# EAGLE design CAB_decoder_SMD (EAGLE 9.6.1)
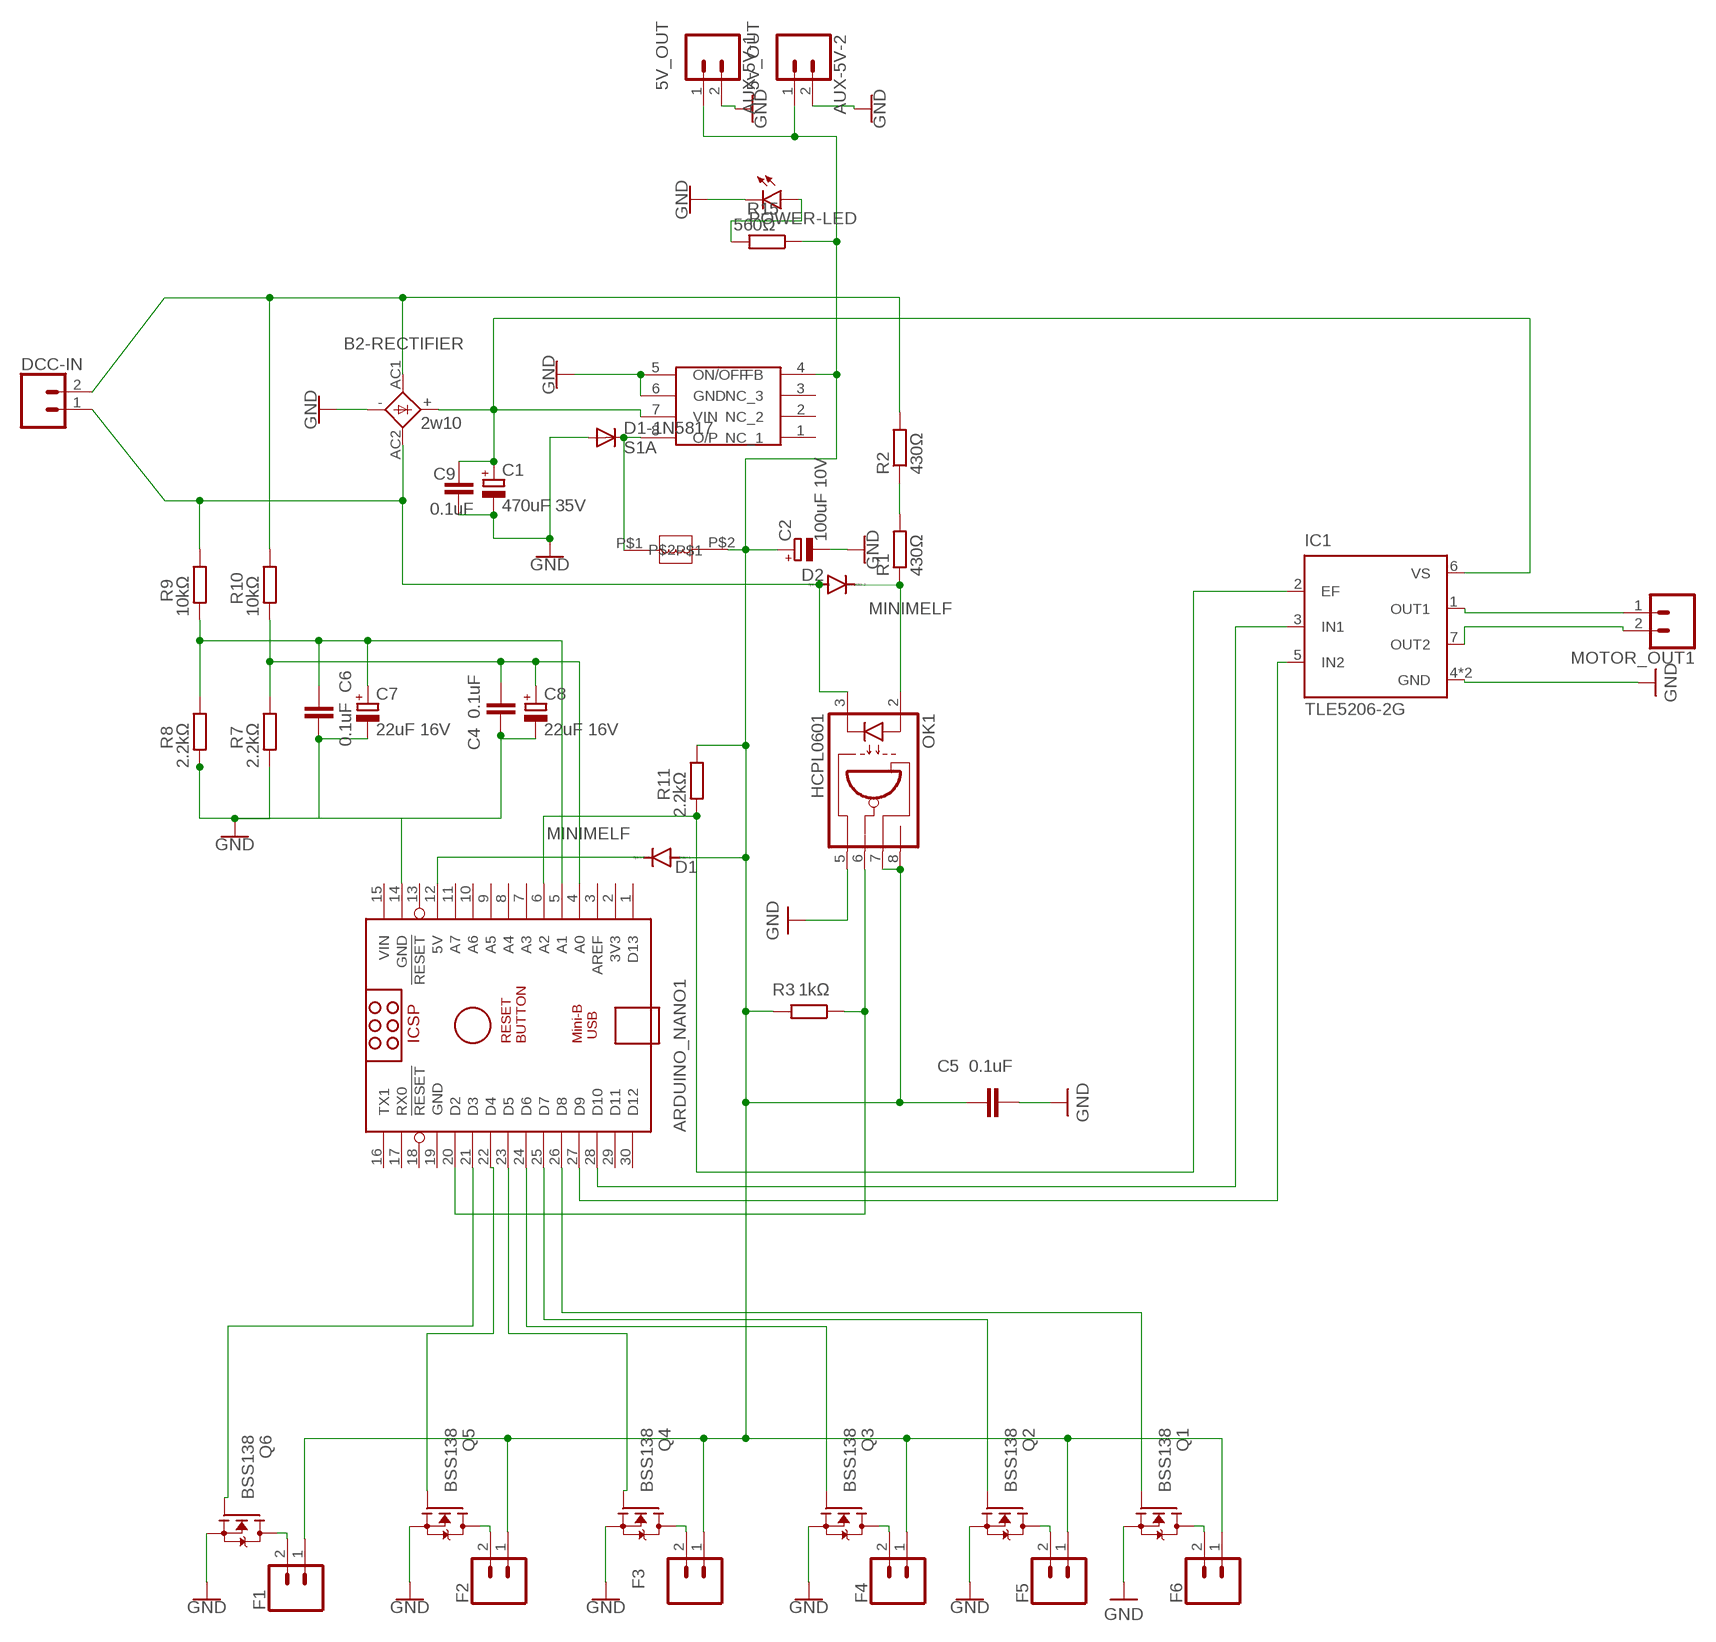
[diagram p0: schematic, sheet 1]

## Parts
ARDUINO_NANO1  ARDUINO_NANO  [ARDUINO_NANO]
AUX-5V-1  5V_OUT  CONN_02POLAR_LOCK  [MOLEX-1X2_LOCK]
AUX-5V-2  5V_OUT  CONN_02POLAR_LOCK  [MOLEX-1X2_LOCK]
B2-RECTIFIER  2w10  1KAB  [1KAB]
C1  470uF 35V  CPOL-EU153CLV-1014  [153CLV-1014]
C2  100uF 10V  CPOL-EU153CLV-0605  [153CLV-0605]
C4  0.1uF  C-EUC1206  [C1206]
C5  0.1uF  C-EUC1206  [C1206]
C6  0.1uF  C-EUC1206  [C1206]
C7  22uF 16V  CPOL-EU153CLV-0405  [153CLV-0405]
C8  22uF 16V  CPOL-EU153CLV-0405  [153CLV-0405]
C9  0.1uF  C-EUC1206  [C1206]
D1  MINIMELF  DIODE-MINIMELF  [MINIMELF]
D1-1N5817  S1A  [DO214AC]
D2  MINIMELF  DIODE-MINIMELF  [MINIMELF]
DCC-IN  CONN_02POLAR_LOCK  [MOLEX-1X2_LOCK]
F1  CONN_02POLAR_LOCK  [MOLEX-1X2_LOCK]
F2  CONN_02POLAR_LOCK  [MOLEX-1X2_LOCK]
F3  CONN_02POLAR_LOCK  [MOLEX-1X2_LOCK]
F4  CONN_02POLAR_LOCK  [MOLEX-1X2_LOCK]
F5  CONN_02POLAR_LOCK  [MOLEX-1X2_LOCK]
F6  CONN_02POLAR_LOCK  [MOLEX-1X2_LOCK]
IC1  TLE5206-2G  [P-TO263-7-1]
MOTOR_OUT1  CONN_02POLAR_LOCK  [MOLEX-1X2_LOCK]
OK1  HCPL0601  [SOIC08]
POWER-LED  LEDCHIPLED_1206  [CHIPLED_1206]
Q1  BSS138  [SOT23]
Q2  BSS138  [SOT23]
Q3  BSS138  [SOT23]
Q4  BSS138  [SOT23]
Q5  BSS138  [SOT23]
Q6  BSS138  [SOT23]
R1  430Ω  R-EU_R2512  [R2512]
R2  430Ω  R-EU_R2512  [R2512]
R3  1kΩ  R-EU_R1206  [R1206]
R7  2.2kΩ  R-EU_R1206  [R1206]
R8  2.2kΩ  R-EU_R1206  [R1206]
R9  10kΩ  R-EU_R1206  [R1206]
R10  10kΩ  R-EU_R1206  [R1206]
R11  2.2kΩ  R-EU_R1206  [R1206]
R15  560Ω  R-EU_R1206  [R1206]
U$1  LM2594  [SOIC8]
U$2  L-CD54  [L_CD54]

## Nets
5V: AUX-5V-1.1 AUX-5V-2.1 C2.+ C5.1 D1.A F1.1 F2.1 F3.1 F4.1 F5.1 F6.1 OK1.7(VE) OK1.8(VCC) R3.2 R11.1 R15.1 U$1.4(FB) U$2.P$2
20V: B2-RECTIFIER.+ C1.+ C9.1 IC1.6(VS) U$1.7(VIN)
GND: ARDUINO_NANO1.14(GND) AUX-5V-1.2 AUX-5V-2.2 B2-RECTIFIER.- C1.- C2.- C4.1 C5.2 C6.2 C7.- C8.- C9.2 D1-1N5817.A IC1.4(GND) IC1.8(GND) OK1.5(GND) POWER-LED.C Q1.2(S) Q2.2(S) Q3.2(S) Q4.2(S) Q5.2(S) Q6.2(S) R7.2 R8.2 U$1.5(ON/OFF) U$1.6(GND)
HV-DCC-SIG-ONE: B2-RECTIFIER.AC2 D2.A DCC-IN.1 OK1.3(C) R9.1
HV-DCC-SIG-TWO: B2-RECTIFIER.AC1 DCC-IN.2 R2.2 R10.1
N$1: D1-1N5817.C U$1.8(O/P) U$2.P$1
N$2: ARDUINO_NANO1.22(D4) Q5.1(G)
N$3: D2.C OK1.2(A) R1.1
N$4: ARDUINO_NANO1.6(A2) IC1.2(EF) R11.2
N$5: R1.2 R2.1
N$6: IC1.7(OUT2) MOTOR_OUT1.2
N$7: ARDUINO_NANO1.5(A1) C6.1 C7.+ R8.1 R9.2
N$8: ARDUINO_NANO1.28(D10) IC1.3(IN1)
N$9: ARDUINO_NANO1.27(D9) IC1.5(IN2)
N$10: ARDUINO_NANO1.21(D3) Q6.1(G)
N$11: ARDUINO_NANO1.4(A0) C4.2 C8.+ R7.1 R10.2
N$12: ARDUINO_NANO1.23(D5) Q4.1(G)
N$13: ARDUINO_NANO1.24(D6) Q3.1(G)
N$14: ARDUINO_NANO1.25(D7) Q2.1(G)
N$15: ARDUINO_NANO1.26(D8) Q1.1(G)
N$16: F6.2 Q1.3(D)
N$17: F5.2 Q2.3(D)
N$18: F3.2 Q4.3(D)
N$19: ARDUINO_NANO1.20(D2) OK1.6(VO) R3.1
N$20: IC1.1(OUT1) MOTOR_OUT1.1
N$21: POWER-LED.A R15.2
N$22: ARDUINO_NANO1.12(5V) D1.C
N$24: F4.2 Q3.3(D)
N$25: F2.2 Q5.3(D)
N$26: F1.2 Q6.3(D)
Unconnected: ARDUINO_NANO1.1(D13) ARDUINO_NANO1.2(3V3) ARDUINO_NANO1.3(AREF) ARDUINO_NANO1.7(A3) ARDUINO_NANO1.8(A4) ARDUINO_NANO1.9(A5) ARDUINO_NANO1.10(A6) ARDUINO_NANO1.11(A7) ARDUINO_NANO1.13(!RESET) ARDUINO_NANO1.16(TX1) ARDUINO_NANO1.17(RX0) ARDUINO_NANO1.18(!RESET) ARDUINO_NANO1.29(D11) ARDUINO_NANO1.30(D12) U$1.1(NC_1) U$1.2(NC_2) U$1.3(NC_3)

## Power pins joined to a net without a drawn wire
GND: ARDUINO_NANO1.19(GND)
VIN: ARDUINO_NANO1.15(VIN)

## Library data of the parts
ARDUINO_NANO1 = ArduinoNanoV30:ARDUINO_NANO: Arduino Nano V3.0 Overview: The Arduino Nano is a small, complete, and breadboard-friendly board based on the ATmega328 (Arduino Nano 3.x) or ATmega168 (Arduino Nano 2.x). It has more or less the same functionality of the Arduino Duemilanove, but in a different package. It lacks only a DC power jack, and works with a Mini-B USB cable instead of a standard one. The Nano was designed and is being produced by Gravitech. Specifications: Microcontroller Atmel ATmega168 or ATmega328 Operating Voltage (logic level) 5 V Input Voltage (recommended) 7-12 V Input Voltage (limits) 6-20 V Digital I/O Pins 14 (of which 6 provide PWM output) Analog Input Pins 8 DC Current per I/O Pin 40 mA Flash Memory 16 KB (ATmega168) or 32 KB (ATmega328) of which 2 KB used by bootloader SRAM 1 KB (ATmega168) or 2 KB (ATmega328) EEPROM 512 bytes (ATmega168) or 1 KB (ATmega328) Clock Speed 16 MHz Dimensions 0.73" x 1.70" Length 45 mm Width 18 mm Weigth 5 g Power: The Arduino Nano can be powered via the Mini-B USB connection, 6-20V unregulated external power supply (pin 30), or 5V regulated external power supply (pin 27). The power source is automatically selected to the highest voltage source. Memory: The ATmega168 has 16 KB of flash memory for storing code (of which 2 KB is used for the bootloader); the ATmega328 has 32 KB, (also with 2 KB used for the bootloader). The ATmega168 has 1 KB of SRAM and 512 bytes of EEPROM (which can be read and written with the EEPROM library); the ATmega328 has 2 KB of SRAM and 1 KB of EEPROM. Input and Output: Each of the 14 digital pins on the Nano can be used as an input or output, using pinMode(), digitalWrite(), and digitalRead() functions. They operate at 5 volts. Each pin can provide or receive a maximum of 40 mA and has an internal pull-up resistor (disconnected by default) of 20-50 kOhms. In addition, some pins have specialized functions. Visit Arduino - ArduinoBoardNano <https://www.arduino.cc/en/Main/ArduinoBoardNano>
AUX-5V-1 AUX-5V-2 F1-F6 = SparkFun-Connectors:CONN_02: Multi connection point. Often used as Generic Header-pin footprint for 0.1 inch spaced/style header connections On any of the 0.1 inch spaced packages, you can populate with these: Break Away Headers - Straight <https://www.sparkfun.com/products/116> (PRT-00116) Break Away Male Headers - Right Angle <https://www.sparkfun.com/products/553> (PRT-00553) Female Headers <https://www.sparkfun.com/products/115> (PRT-00115) Break Away Headers - Machine Pin <https://www.sparkfun.com/products/117> (PRT-00117) Break Away Female Headers - Swiss Machine Pin <https://www.sparkfun.com/products/743> (PRT-00743) For SCREWTERMINALS and SPRING TERMINALS visit here: Screw Terimnals on SparkFun.com <https://www.sparkfun.com/search/results?term=Screw+Terminals> (5mm/3.5mm/2.54mm spacing) This device is also useful as a general connection point to wire up your design to another part of your project. Our various solder wires solder well into these plated through hole pads. Hook-Up Wire - Assortment (Stranded, 22 AWG) <https://www.sparkfun.com/products/11375> (PRT-11375) Hook-Up Wire - Assortment (Solid Core, 22 AWG) <https://www.sparkfun.com/products/11367> (PRT-11367) View the entire wire category on our website here <https://www.sparkfun.com/categories/141> Special notes: Molex polarized connector foot print use with: PRT-08233 with associated crimp pins and housings. 2.54_SCREWTERM for use with PRT-10571. 3.5mm Screw Terminal footprints for PRT-08084 5mm Screw Terminal footprints for use with PRT-08432; SF_ID: PRT-09918
B2-RECTIFIER = rectifier:1KAB: RECTIFIER grid 5,08 x 5,08 mm; SPICEPREFIX: E
C1 C2 C7 C8 = rcl:CPOL-EU: POLARIZED CAPACITOR, European symbol; SPICEPREFIX: C
C4-C6 C9 = rcl:C-EU: CAPACITOR, European symbol; SPICEPREFIX: C
D1 D2 = diode:DIODE-: DIODE
D1-1N5817 = s1x_10:S1*: S1A - S1M General Purpose Rectifiers Source: http://www.fairchildsemi.com/datasheets/S1/S1A.pdf; MF: Fairchild; MPN: S1A; OC_FARNELL: 9843868; OC_NEWARK: 58K9551
DCC-IN MOTOR_OUT1 = SparkFun-Connectors:CONN_02: Multi connection point. Often used as Generic Header-pin footprint for 0.1 inch spaced/style header connections On any of the 0.1 inch spaced packages, you can populate with these: Break Away Headers - Straight <https://www.sparkfun.com/products/116> (PRT-00116) Break Away Male Headers - Right Angle <https://www.sparkfun.com/products/553> (PRT-00553) Female Headers <https://www.sparkfun.com/products/115> (PRT-00115) Break Away Headers - Machine Pin <https://www.sparkfun.com/products/117> (PRT-00117) Break Away Female Headers - Swiss Machine Pin <https://www.sparkfun.com/products/743> (PRT-00743) For SCREWTERMINALS and SPRING TERMINALS visit here: Screw Terimnals on SparkFun.com <https://www.sparkfun.com/search/results?term=Screw+Terminals> (5mm/3.5mm/2.54mm spacing) This device is also useful as a general connection point to wire up your design to another part of your project. Our various solder wires solder well into these plated through hole pads. Hook-Up Wire - Assortment (Stranded, 22 AWG) <https://www.sparkfun.com/products/11375> (PRT-11375) Hook-Up Wire - Assortment (Solid Core, 22 AWG) <https://www.sparkfun.com/products/11367> (PRT-11367) View the entire wire category on our website here <https://www.sparkfun.com/categories/141> Special notes: Molex polarized connector foot print use with: PRT-08233 with associated crimp pins and housings. 2.54_SCREWTERM for use with PRT-10571. 3.5mm Screw Terminal footprints for PRT-08084 5mm Screw Terminal footprints for use with PRT-08432; SF_ID: PRT-09918; SPICEPREFIX: V
IC1 = HBridge:TLE5206-2: 5-A H-Bridge for DC-Motor Applications Source: https://www.infineon.com/cms/en/product/power/motor-control-ics/brushed-dc-motor-driver-ics/integrated-full-bridge-driver/tle5206-2g/; OC_FARNELL: unknown; OC_NEWARK: unknown
OK1 = optocoupler:HCPL0601: HEWLETT PACKARD OPTO COUPLER; MF: AGILENT TECHNOLOGIES; MPN: HCPL-0601-000E; OC_FARNELL: 9995102; OC_NEWARK: 88H7776
POWER-LED = led:LED: LED OSRAM: - CHIPLED LG R971, LG N971, LY N971, LG Q971, LY Q971, LO R971, LY R971 LH N974, LH R974 LS Q976, LO Q976, LY Q976 LO Q996 - Hyper CHIPLED LW Q18S LB Q993, LB Q99A, LB R99A - SideLED LS A670, LO A670, LY A670, LG A670, LP A670 LB A673, LV A673, LT A673, LW A673 LH A674 LY A675 LS A676, LA A676, LO A676, LY A676, LW A676 LS A679, LY A679, LG A679 - Hyper Micro SIDELED® LS Y876, LA Y876, LO Y876, LY Y876 LT Y87S - SmartLED LW L88C, LW L88S LB L89C, LB L89S, LG L890 LS L89K, LO L89K, LY L89K LS L896, LA L896, LO L896, LY L896 - TOPLED LS T670, LO T670, LY T670, LG T670, LP T670 LSG T670, LSP T670, LSY T670, LOP T670, LYG T670 LG T671, LOG T671, LSG T671 LB T673, LV T673, LT T673, LW T673 LH T674 LS T676, LA T676, LO T676, LY T676, LB T676, LH T676, LSB T676, LW T676 LB T67C, LV T67C, LT T67C, LS T67K, LO T67K, LY T67K, LW E67C LS E67B, LA E67B, LO E67B, LY E67B, LB E67C, LV E67C, LT E67C LW T67C LS T679, LY T679, LG T679 LS T770, LO T770, LY T770, LG T770, LP T770 LB T773, LV T773, LT T773, LW T773 LH T774 LS E675, LA E675, LY E675, LS T675 LS T776, LA T776, LO T776, LY T776, LB T776 LHGB T686 LT T68C, LB T68C - Hyper Mini TOPLED® LB M676 - Mini TOPLED Santana® LG M470 LS M47K, LO M47K, LY M47K Source: http://www.osram.convergy.de LUXEON: - LUMILED® LXK2-PW12-R00, LXK2-PW12-S00, LXK2-PW14-U00, LXK2-PW14-V00 LXK2-PM12-R00, LXK2-PM12-S00, LXK2-PM14-U00 LXK2-PE12-Q00, LXK2-PE12-R00, LXK2-PE12-S00, LXK2-PE14-T00, LXK2-PE14-U00 LXK2-PB12-K00, LXK2-PB12-L00, LXK2-PB12-M00, LXK2-PB14-N00, LXK2-PB14-P00, LXK2-PB14-Q00 LXK2-PR12-L00, LXK2-PR12-M00, LXK2-PR14-Q00, LXK2-PR14-R00 LXK2-PD12-Q00, LXK2-PD12-R00, LXK2-PD12-S00 LXK2-PH12-R00, LXK2-PH12-S00 LXK2-PL12-P00, LXK2-PL12-Q00, LXK2-PL12-R00 Source: www.luxeon.com KINGBRIGHT: KA-3528ASYC Source: www.kingbright.com
Q1-Q6 = bss138_10:BSS138: BSS138 N-Channel Logic Level Enhancement Mode Field Effect Transistor Source: http://www.fairchildsemi.com/datasheets/BS/BSS138.pdf; MF: Fairchild; MPN: BSS138; OC_FARNELL: 9845330; OC_NEWARK: 67R2009
R1-R3 R7-R11 R15 = rcl:R-EU_: RESISTOR, European symbol; SPICEPREFIX: R
U$1 = LM2594:LM2594: LM2594 SIMPLE SWITCHER SOIC8 LM2594/LM2594HV SIMPLE SWITCHER® Power Converter 150 kHz 0.5A Step-Down Voltage Regulator
U$2 = Inductor:L-CD54: Inductor CD54 Footprint

## Board
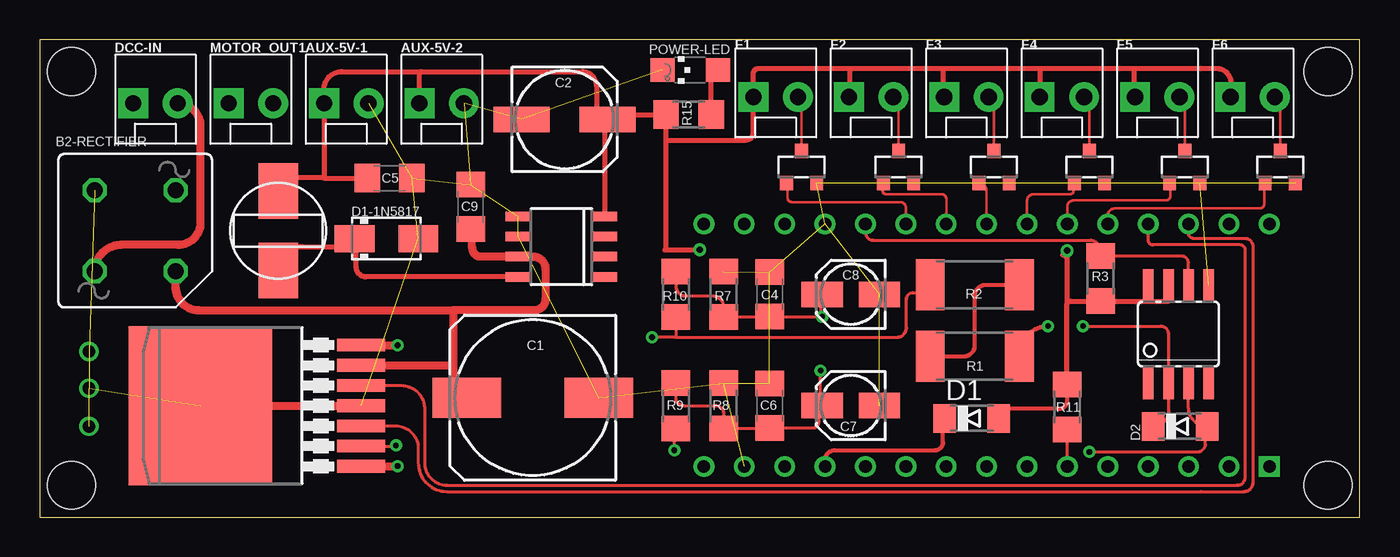
[diagram p1: board, top side]
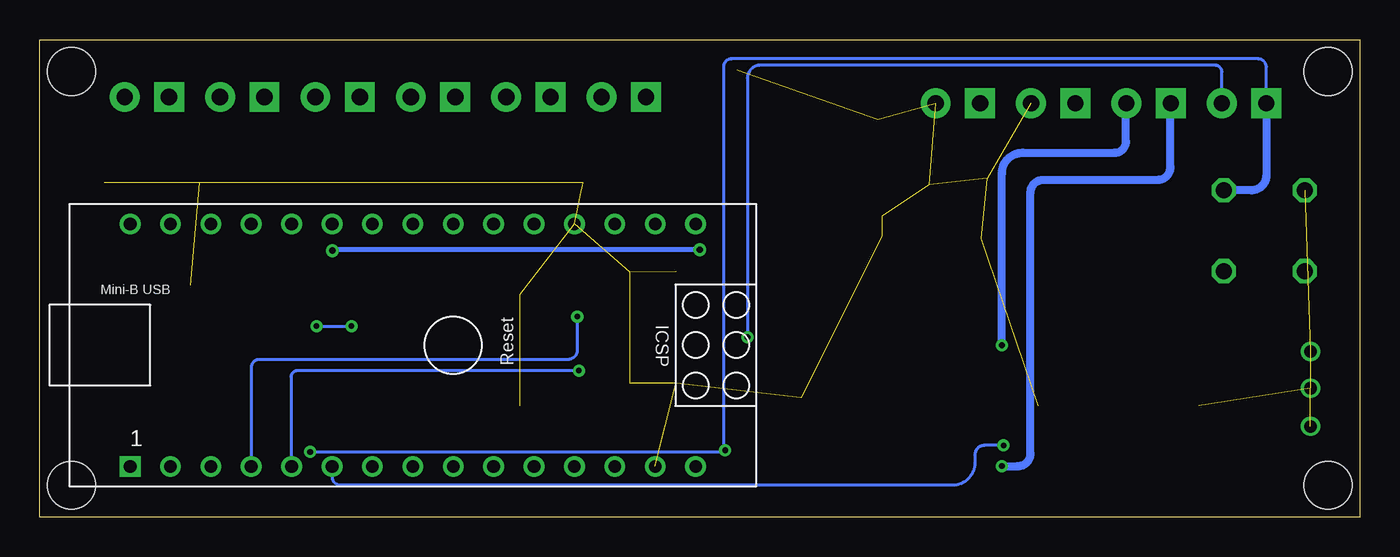
[diagram p2: board, bottom side, seen from below]

Size 83 x 30 mm. Coordinates in mm from the lower left corner, seen from the top.
Outline: 0,0 83,0 83,30 0,30 0,0
Copper layers (1*16): Top 0.035mm / dielectric 1.5mm / Bottom 0.035mm
Design rules "default": minimum track width 6mil, minimum drill 0.35mm, track to track 6mil, track to pad 6mil, pad to pad 6mil, via to via 6mil, smd to smd 6mil, copper to edge 40mil, drill to drill 6mil, minimum pad ring 10mil, minimum via ring 8mil, stop-mask expansion 4mil, vias tented up to drill 0mil, thermal gap 10mil
Holes 3 mm at 2,28 2,2 81,2 81,28

### Footprints (pad centres in the part's own frame; a part is rotated, then mirrored left to right if it is on the bottom)
ARDUINO_NANO = drill 0.8 square: 1 -20.32,-7.62 | drill 0.8: 2 -17.78,-7.62; 3 -15.24,-7.62; 4 -12.7,-7.62; 5 -10.16,-7.62; 6 -7.62,-7.62; 7 -5.08,-7.62; 8 -2.54,-7.62; 9 0,-7.62; 10 2.54,-7.62; 11 5.08,-7.62; 12 7.62,-7.62; 13 10.16,-7.62; 14 12.7,-7.62; 15 15.24,-7.62; 16 15.24,7.62; 17 12.7,7.62; 18 10.16,7.62; 19 7.62,7.62; 20 5.08,7.62; 21 2.54,7.62; 22 0,7.62; 23 -2.54,7.62; 24 -5.08,7.62; 25 -7.62,7.62; 26 -10.16,7.62; 27 -12.7,7.62; 28 -15.24,7.62; 29 -17.78,7.62; 30 -20.32,7.62
MOLEX-1X2_LOCK = drill 1.016 pad 1.88 square: 1 -0.127,0 | drill 1.016 pad 1.88: 2 2.667,0
1KAB = drill 1.016 octagon: + 2.54,-2.54; - -2.54,2.54; AC1 -2.54,-2.54; AC2 2.54,2.54
153CLV-1014 = smd 4.3 x 2.5: + 4.15,0; - -4.15,0
153CLV-0605 = smd 3.5 x 1.6: + 2.7,0; - -2.7,0
C1206 = smd 1.6 x 1.8: 1 -1.4,0; 2 1.4,0
153CLV-0405 = smd 2.6 x 1.6: + 1.8,0; - -1.8,0
MINIMELF = smd 1.4 x 1.8: A 1.7,0; C -1.7,0
DO214AC = smd 2.5 x 1.7: A 2,0; C -2,0
P-TO263-7-1 = smd 0.8 x 3: 1 -3.81,-9.207; 2 -2.54,-9.207; 3 -1.27,-9.207; 4 0,-9.207; 5 1.27,-9.207; 6 2.54,-9.207; 7 3.81,-9.207 | smd 10 x 9: 8 0,0.895
SOIC08 = smd 0.66 x 2.032: 1 -1.905,-3.073; 2 -0.635,-3.073; 3 0.635,-3.073; 4 1.905,-3.073; 5 1.905,3.073; 6 0.635,3.073; 7 -0.635,3.073; 8 -1.905,3.073
CHIPLED_1206 = smd 1.5 x 1.5: A 0,-1.75; C 0,1.75
SOT23 = smd 0.8 x 0.9: 1 -0.95,-1; 2 0.95,-1; 3 0,1
R2512 = smd 1.8 x 3.2: 1 -2.8,0; 2 2.8,0
R1206 = smd 1.6 x 1.803: 1 -1.422,0; 2 1.422,0
SOIC8 = smd 0.6 x 1.5: 1 -1.905,-2.75; 2 -0.635,-2.75; 3 0.635,-2.75; 4 1.905,-2.75; 5 1.905,2.75; 6 0.635,2.75; 7 -0.635,2.75; 8 -1.905,2.75
L_CD54 = smd 2.5 x 3.5: P$1 0,2.5; P$2 0,-2.5

### Placement (x,y rotation side)
ARDUINO_NANO1  57,10.8 0 bottom
AUX-5V-1  18,26 0 top
AUX-5V-2  24,26 0 top
B2-RECTIFIER  6,18 0 top
C1  31,7.5 180 top
C2  33,25 0 top
C4  45.9,14 270 top
C5  22,21.3 0 top
C6  45.9,7 90 top
C7  51,7 180 top
C8  51,14 180 top
C9  27.1,19.5 90 top
D1  58.6,6.2 0 top
D1-1N5817  21.8,17.5 0 top
D2  71.7,5.7 0 top
DCC-IN  6,26 0 top
F1  45,26.4 0 top
F2  51,26.4 0 top
F3  57,26.4 0 top
F4  63,26.4 0 top
F5  69,26.4 0 top
F6  75,26.4 0 top
IC1  11,7 90 top
MOTOR_OUT1  12,26 0 top
OK1  71.6,11.5 0 top
POWER-LED  40.9,28.1 90 top
Q1  78,22 0 top
Q2  72,22 0 top
Q3  66,22 0 top
Q4  60,22 0 top
Q5  54,22 0 top
Q6  47.9,22 0 top
R1  58.8,10.1 180 top
R2  58.8,14.6 180 top
R3  66.7,15 270 top
R7  43,14 90 top
R8  43,7 90 top
R9  40,7 90 top
R10  40,14 90 top
R11  64.6,6.92 270 top
R15  40.8,25.3 0 top
U$1  32.8,17 90 top
U$2  15,18 180 top

### Tracks (layer width: path | path; a pad name or v marks a point on that pad's centre or on a via)
5V  (via drill 0.4)
  Top 0.254: R11.1 64.6,7.3 arc-90 64.1,6.8 60.9,6.8 arc90 D1.A
  Top 0.3: 24,28 19,28 arc90 17.87,26.87 AUX-5V-1.1 17.87,21.33 | C2.+ arc-90 35,25.7 35,27.1 arc90 34.1,28 24,28 | AUX-5V-2.1 23.87,27.87 arc-90 24,28 | C2.+ arc-90 36,25.3 39.3,25.3 | 39.3,25.3 R15.1 | 39.3,25.3 arc-90 39.36,25.24 39.36,23.7 | 39.36,23.7 44.4,23.7 arc90 44.87,24.17 F1.1 44.87,27.87 arc-90 45.2,28.2 50.9,28.2 | 50.9,28.2 56.8,28.2 | 56.8,28.2 62.9,28.2 | 62.9,28.2 68.8,28.2 | 68.8,28.2 74,28.2 arc-90 74.9,27.3 74.9,26.43 arc-90 F6.1 | 68.8,28.2 68.8,26.47 arc90 F5.1 | 62.9,28.2 62.9,26.43 arc-90 F4.1 | 56.8,28.2 56.8,26.47 arc90 F3.1 | 50.9,28.2 50.9,26.43 arc-90 F2.1 | R11.1 64.6,13.4 | 64.6,13.4 arc-90 64.78,13.58 R3.2 69.7,13.58 | 69.7,13.58 70.98,13.58 arc90 71,13.6 71,14.54 arc90 OK1.7 | OK1.8 arc-90 OK1.8 69.7,13.58 | 64.6,13.4 64.6,16.2 arc90 64.33,16.47 arc90 v64.6,16.74 | C5.1 17.9,21.3 arc-90 17.87,21.33 | 39.36,16.86 arc-90 39.3,16.8 | 39.36,23.7 39.36,16.86 | 39.36,16.86 arc90 39.42,16.8 v41.5,16.8 | 17.87,21.33 15.83,21.33 arc90 U$2.P$2 | 35.55,24.85 arc-90 C2.+ | U$1.4 35.55,24.85 | 35.55,24.85 C2.+
  Bottom 0.3: v41.5,16.8 64.54,16.8 arc-90 v64.6,16.74
20V
  Top 0.508: IC1.6 26,9.54 | 26,8.35 arc-90 C1.+ arc-90 26,8.35 | B2-RECTIFIER.+ 8.54,14.46 arc90 10,13 26,13 | 26,9.54 26,8.35 | 26,13 26,9.54 | C9.1 arc-90 27.2,18 27.2,16.9 arc90 27.73,16.36 U$1.7 31.04,16.36 arc-90 31.8,15.6 31.8,13.7 arc-90 31.1,13 26,13
GND  (via drill 0.8)  (29 unrouted)
  Top 0.508: IC1.8 IC1.4
  other vias: 3.1,10.4 3.1,8.1 3.1,5.7
HV-DCC-SIG-ONE  (via drill 0.35)
  Top 0.2: R9.1 arc90 39.9,5.48 v39.9,4.2 | OK1.3 72.23,6.87 arc90 D2.A arc90 73.3,5.6 73.3,4.6 arc-90 72.8,4.1 v66,4.1
  Bottom 0.2: v66,4.1 40,4.1 v39.9,4.2 arc90 40,4.3 40,28.3 arc90 39.5,28.8 6.4,28.8 arc90 5.87,28.27 DCC-IN.1
  Bottom 0.508: DCC-IN.1 5.87,21.48 arc90 6.81,20.54 B2-RECTIFIER.AC2
HV-DCC-SIG-TWO  (via drill 0.35)
  Top 0.2: R10.1 40,11.3 | 40,11.3 39.9,11.3 v38.5,11.3 | 40,11.3 53.9,11.3 arc90 54.5,11.9 54.5,13.7 arc-90 54.9,14.1 55.5,14.1 arc90 R2.2
  Top 0.508: DCC-IN.2 arc-90 10.1,24.57 10.1,18.5 arc-90 8.7,17.1 5.1,17.1 arc90 B2-RECTIFIER.AC1
  Bottom 0.2: DCC-IN.2 8.67,27.97 arc-90 9.1,28.4 37.7,28.4 arc-90 38.5,27.6 v38.5,11.3
N$1
  Top 0.3: U$2.P$1 arc-90 16.5,17 19.3,17 arc90 D1-1N5817.C arc-90 19.9,17.4 19.9,15.7 arc90 20.5,15.1 U$1.8
N$2
  Top 0.152: ARDUINO_NANO1.22 57,20 arc90 56.7,20.3 53.2,20.3 arc-90 53,20.5 53,20.95 arc-90 Q5.1
N$3  (via drill 0.35)
  Top 0.2: v65.6,12 70.49,12 arc-90 70.97,11.53 OK1.2 71,8.43 71,6.7 arc-90 D2.C
  Top 0.254: R1.1 61.6,10.2 arc-90 v63.4,12
  Bottom 0.2: v65.6,12 v63.4,12
N$4  (via drill 0.35)
  Top 0.2: IC1.2 22.36,4.46 arc90 v22.4,4.5 | ARDUINO_NANO1.6 64.62,5.48 arc-90 R11.2
  Bottom 0.2: v22.4,4.5 23.6,4.5 arc-90 24.2,3.9 24.2,3.4 arc90 25.6,2 64.1,2 arc90 64.6,2.5 64.6,3.16 arc-90 ARDUINO_NANO1.6
N$5
  Top 0.254: R1.2 58.1,10.1 arc90 58.8,10.8 58.8,13.9 arc-90 59.5,14.6 R2.1
N$6  (via drill 0.35)
  Top 0.508: IC1.7 v22.49,10.81 arc-90 v22.5,10.8
  Bottom 0.508: v22.5,10.8 22.5,21.6 arc90 21.2,22.9 15.4,22.9 arc-90 14.7,23.6 14.7,25.97 arc90 MOTOR_OUT1.2
N$7  (via drill 0.35)
  Top 0.2: C6.1 48.6,5.6 arc90 49,6 49,6.8 arc-90 C7.+ arc-90 49.1,7.1 v49.1,9.2 | 45.88,5.58 R8.1 43,6.5 arc90 42.5,7 40.5,7 arc-90 40,7.5 R9.2
  Top 0.3: 45.88,5.58 arc90 C6.1
  Bottom 0.2: v49.1,9.2 66.8,9.2 arc-90 67.2,8.8 67.2,3.22 arc-90 ARDUINO_NANO1.5
N$8
  Top 0.2: IC1.3 22.37,5.73 arc-90 23.8,4.3 23.8,3.4 arc90 25.6,1.6 73,1.6 73.1,1.6 75.7,1.6 arc90 76.3,2.2 76.3,17 arc90 75.8,17.5 72.6,17.5 arc-90 72.2,17.9 72.2,18.38 arc-90 ARDUINO_NANO1.28
N$9
  Top 0.2: IC1.5 22.73,8.27 arc-90 24.2,6.8 24.2,3.4 arc90 25.6,2 75.3,2 arc90 75.8,2.5 75.8,16.8 arc90 75.5,17.1 70,17.1 arc-90 69.7,17.4 ARDUINO_NANO1.27
N$10
  Top 0.152: ARDUINO_NANO1.21 54.46,19.44 arc90 54.1,19.8 47.3,19.8 arc-90 47,20.1 47,20.95 arc90 Q6.1
N$11  (via drill 0.35)
  Top 0.2: R10.2 40,14.5 arc90 40.6,13.9 42.3,13.9 arc-90 43,13.2 R7.1 arc-90 43.02,12.6 C4.2 v49.2,12.6 arc-90 49.1,12.7 49.1,13.9 arc-90 C8.+
  Bottom 0.2: v49.2,12.6 49.2,10.5 arc90 49.8,9.9 69.2,9.9 arc-90 69.7,9.4 ARDUINO_NANO1.4
N$12
  Top 0.152: ARDUINO_NANO1.23 59.54,20.51 arc90 Q4.1
N$13
  Top 0.152: ARDUINO_NANO1.24 62.08,19.88 arc-90 62.5,20.3 64.8,20.3 arc90 65,20.5 65,20.95 arc-90 Q3.1
N$14
  Top 0.152: ARDUINO_NANO1.25 64.62,19.52 arc-90 65,19.9 70.8,19.9 arc90 71.1,20.2 71.1,20.95 arc90 Q2.1
N$15
  Top 0.152: ARDUINO_NANO1.26 67.16,18.96 arc-90 67.6,19.4 76.7,19.4 arc90 77,19.7 77,20.95 arc-90 Q1.1
N$16
  Top 0.152: Q1.3 78,26.07 arc90 F6.2
N$17
  Top 0.152: Q2.3 72,26.07 arc90 F5.2
N$18
  Top 0.152: Q4.3 60,26.07 arc90 F3.2
N$19
  Top 0.2: ARDUINO_NANO1.20 51.92,17.88 arc90 52.4,17.4 66.1,17.4 arc-90 66.6,16.9 66.6,16.52 arc90 R3.1 arc90 66.72,16.4 71.8,16.4 arc-90 72.23,15.96 OK1.6
N$20  (via drill 0.35)
  Top 0.508: IC1.1 v22.49,3.19 arc90 v22.5,3.2
  Bottom 0.508: v22.5,3.2 21.5,3.2 arc-90 20.7,4 20.7,20.4 arc90 19.9,21.2 12.7,21.2 arc-90 11.9,22 11.9,25.97 arc90 MOTOR_OUT1.1
N$21
  Top 0.3: R15.2 42.22,27.67 arc-90 POWER-LED.A
N$22
  Top 0.254: ARDUINO_NANO1.12 49.38,3.58 arc-90 50,4.2 56.3,4.2 arc90 56.8,4.7 56.8,6.1 arc-90 D1.C
N$24
  Top 0.152: Q3.3 66,26.07 arc90 F4.2
N$25
  Top 0.152: Q5.3 54,26.07 arc90 F2.2
N$26
  Top 0.152: Q6.3 47.9,26.17 arc90 F1.2